# EAGLE design atmega328p (EAGLE 7.4.0)
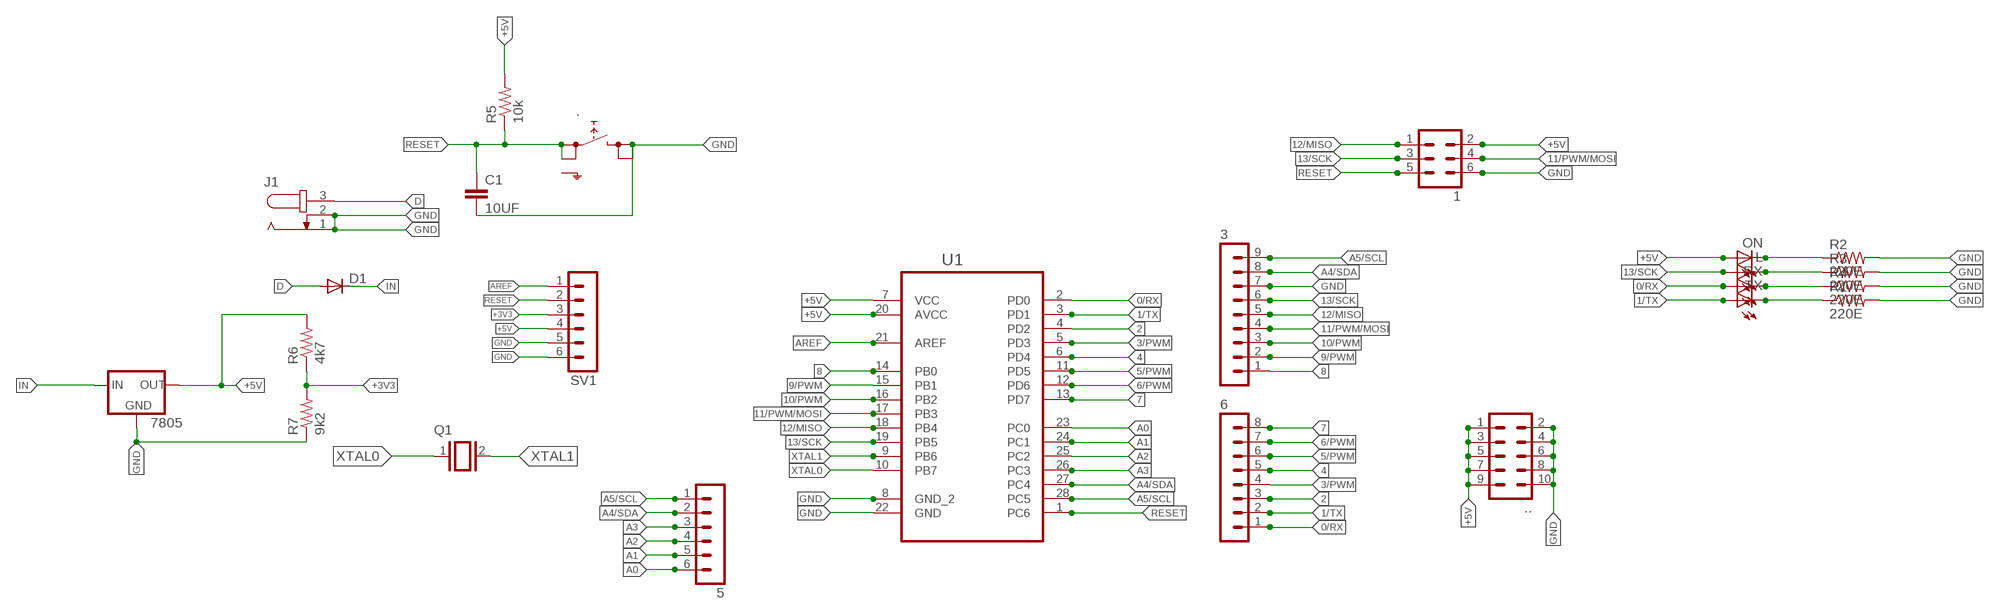
[diagram p0: schematic, sheet 1]

## Parts
1  MA03-2  [MA03-2]
3  MA09-1  [MA09-1]
5  MA06-1  [MA06-1]
6  MA08-1  [MA08-1]
7805  78XXS  [78XXS]
.  SKHMPSE010  [SKHMPXE010]
..  MA05-2  [MA05-2]
C1  10UF  C-EU025-025X050  [C025-025X050]
D1  1N4004  [DO41-10]
J1  JACK-PLUG0  [SPC4077]
L  LEDCHIP-LED0805  [CHIP-LED0805]
ON  LEDCHIP-LED0805  [CHIP-LED0805]
Q1  XTAL/S  [QS]
R1  220E  R-US_0204/7  [0204/7]
R2  220E  R-US_0204/7  [0204/7]
R3  220E  R-US_0204/7  [0204/7]
R4  220E  R-US_0204/7  [0204/7]
R5  10k  R-US_0204/7  [0204/7]
R6  4k7  R-US_0204/7  [0204/7]
R7  9k2  R-US_0204/7  [0204/7]
RX  LEDCHIP-LED0805  [CHIP-LED0805]
SV1  MA06-1  [MA06-1]
TX  LEDCHIP-LED0805  [CHIP-LED0805]
U1  ATMEGA328P-PU  [DIP254P762X457-28]

## Nets
0/RX: 6.1 RX.A U1.2(PD0)
1/TX: 6.2 TX.A U1.3(PD1)
2: 6.3 U1.4(PD2)
3/PWM: 6.4 U1.5(PD3)
4: 6.5 U1.6(PD4)
5/PWM: 6.6 U1.11(PD5)
6/PWM: 6.7 U1.12(PD6)
7: 6.8 U1.13(PD7)
8: 3.1 U1.14(PB0)
9/PWM: 3.2 U1.15(PB1)
10/PWM: 3.3 U1.16(PB2)
11/PWM/MOSI: 1.4 3.4 U1.17(PB3)
12/MISO: 1.1 3.5 U1.18(PB4)
13/SCK: 1.3 3.6 L.A U1.19(PB5)
+3V3: R6.1 R7.2 SV1.3
+5V: 1.2 7805.OUT ...1 ...3 ...5 ...7 ...9 ON.A R5.2 R6.2 SV1.4 U1.7(VCC) U1.20(AVCC)
A0: 5.6 U1.23(PC0)
A1: 5.5 U1.24(PC1)
A2: 5.4 U1.25(PC2)
A3: 5.3 U1.26(PC3)
A4/SDA: 3.8 5.2 U1.27(PC4)
A5/SCL: 3.9 5.1 U1.28(PC5)
AREF: SV1.1 U1.21(AREF)
D: D1.A J1.3
GND: 1.6 3.7 7805.GND ..3(2.1) ..4(2.2) ...2 ...4 ...6 ...8 ...10 C1.2 J1.1 J1.2 R1.2 R2.2 R3.2 R4.2 R7.1 SV1.5 SV1.6 U1.8(GND_2) U1.22(GND)
IN: 7805.IN D1.C
N$4: ON.C R2.1
N$5: L.C R3.1
N$6: R4.1 RX.C
N$7: R1.1 TX.C
RESET: 1.5 ..1(1.1) ..2(1.2) C1.1 R5.1 SV1.2 U1.1(PC6)
XTAL0: Q1.1 U1.10(PB7)
XTAL1: Q1.2 U1.9(PB6)
Unconnected: ..5(SH)

## Library data of the parts
1 = con-lstb:MA03-2: PIN HEADER; OC_FARNELL: unknown; OC_NEWARK: unknown
3 = con-lstb:MA09-1: PIN HEADER; OC_FARNELL: unknown; OC_NEWARK: unknown
5 SV1 = con-lstb:MA06-1: PIN HEADER; OC_FARNELL: unknown; OC_NEWARK: unknown
6 = con-lstb:MA08-1: PIN HEADER; OC_FARNELL: unknown; OC_NEWARK: unknown
7805 = v-reg:78XXS: VOLTAGE REGULATOR
. = switch:SKHMP*E010: 6.2 X 6.5mm TACT Switch (SMD) Source: http://www3.alps.co.jp/WebObjects/catalog.woa/PDF/E/Switch/Tact/SKHM/SKHM.PDF
.. = con-lstb:MA05-2: PIN HEADER; OC_FARNELL: unknown; OC_NEWARK: unknown
C1 = rcl:C-EU: CAPACITOR, European symbol
D1 = diode:1N4004: DIODE general purpose rectifier, 1 A
J1 = con-jack:JACK-PLUG: DC POWER JACK Power Jack, DC, Right Angle, Through Hole, Rated 5A at 16VDC, PC Terminals Distributor: Farnell (www.Farnell.de) Drawing: 84N1161.pdf / 84N1162.pdf Manufacturer: SPC Technology (www.spctechnology.com) Type: SPC4077 / SPC 4078; OC_FARNELL: unknown; OC_NEWARK: unknown
L ON RX TX = led:LED: LED OSRAM: - CHIPLED LG R971, LG N971, LY N971, LG Q971, LY Q971, LO R971, LY R971 LH N974, LH R974 LS Q976, LO Q976, LY Q976 LO Q996 - Hyper CHIPLED LW Q18S LB Q993, LB Q99A, LB R99A - SideLED LS A670, LO A670, LY A670, LG A670, LP A670 LB A673, LV A673, LT A673, LW A673 LH A674 LY A675 LS A676, LA A676, LO A676, LY A676, LW A676 LS A679, LY A679, LG A679 - Hyper Micro SIDELED® LS Y876, LA Y876, LO Y876, LY Y876 LT Y87S - SmartLED LW L88C, LW L88S LB L89C, LB L89S, LG L890 LS L89K, LO L89K, LY L89K LS L896, LA L896, LO L896, LY L896 - TOPLED LS T670, LO T670, LY T670, LG T670, LP T670 LSG T670, LSP T670, LSY T670, LOP T670, LYG T670 LG T671, LOG T671, LSG T671 LB T673, LV T673, LT T673, LW T673 LH T674 LS T676, LA T676, LO T676, LY T676, LB T676, LH T676, LSB T676, LW T676 LB T67C, LV T67C, LT T67C, LS T67K, LO T67K, LY T67K, LW E67C LS E67B, LA E67B, LO E67B, LY E67B, LB E67C, LV E67C, LT E67C LW T67C LS T679, LY T679, LG T679 LS T770, LO T770, LY T770, LG T770, LP T770 LB T773, LV T773, LT T773, LW T773 LH T774 LS E675, LA E675, LY E675, LS T675 LS T776, LA T776, LO T776, LY T776, LB T776 LHGB T686 LT T68C, LB T68C - Hyper Mini TOPLED® LB M676 - Mini TOPLED Santana® LG M470 LS M47K, LO M47K, LY M47K Source: http://www.osram.convergy.de LUXEON: - LUMILED® LXK2-PW12-R00, LXK2-PW12-S00, LXK2-PW14-U00, LXK2-PW14-V00 LXK2-PM12-R00, LXK2-PM12-S00, LXK2-PM14-U00 LXK2-PE12-Q00, LXK2-PE12-R00, LXK2-PE12-S00, LXK2-PE14-T00, LXK2-PE14-U00 LXK2-PB12-K00, LXK2-PB12-L00, LXK2-PB12-M00, LXK2-PB14-N00, LXK2-PB14-P00, LXK2-PB14-Q00 LXK2-PR12-L00, LXK2-PR12-M00, LXK2-PR14-Q00, LXK2-PR14-R00 LXK2-PD12-Q00, LXK2-PD12-R00, LXK2-PD12-S00 LXK2-PH12-R00, LXK2-PH12-S00 LXK2-PL12-P00, LXK2-PL12-Q00, LXK2-PL12-R00 Source: www.luxeon.com KINGBRIGHT: KA-3528ASYC Source: www.kingbright.com
Q1 = special:XTAL/S: CRYSTAL
R1-R7 = rcl:R-US_: RESISTOR, American symbol
U1 = Atmel_By_element14_Batch_1-00:ATMEGA328P-PU: 8-bit Microcontroller with In-System Programmable Flash; MPN: ATMEGA328P-PU; OC_FARNELL: 1715487; OC_NEWARK: 15R0268; PACKAGE: PDIP-28; SUPPLIER: Atmel

## Board
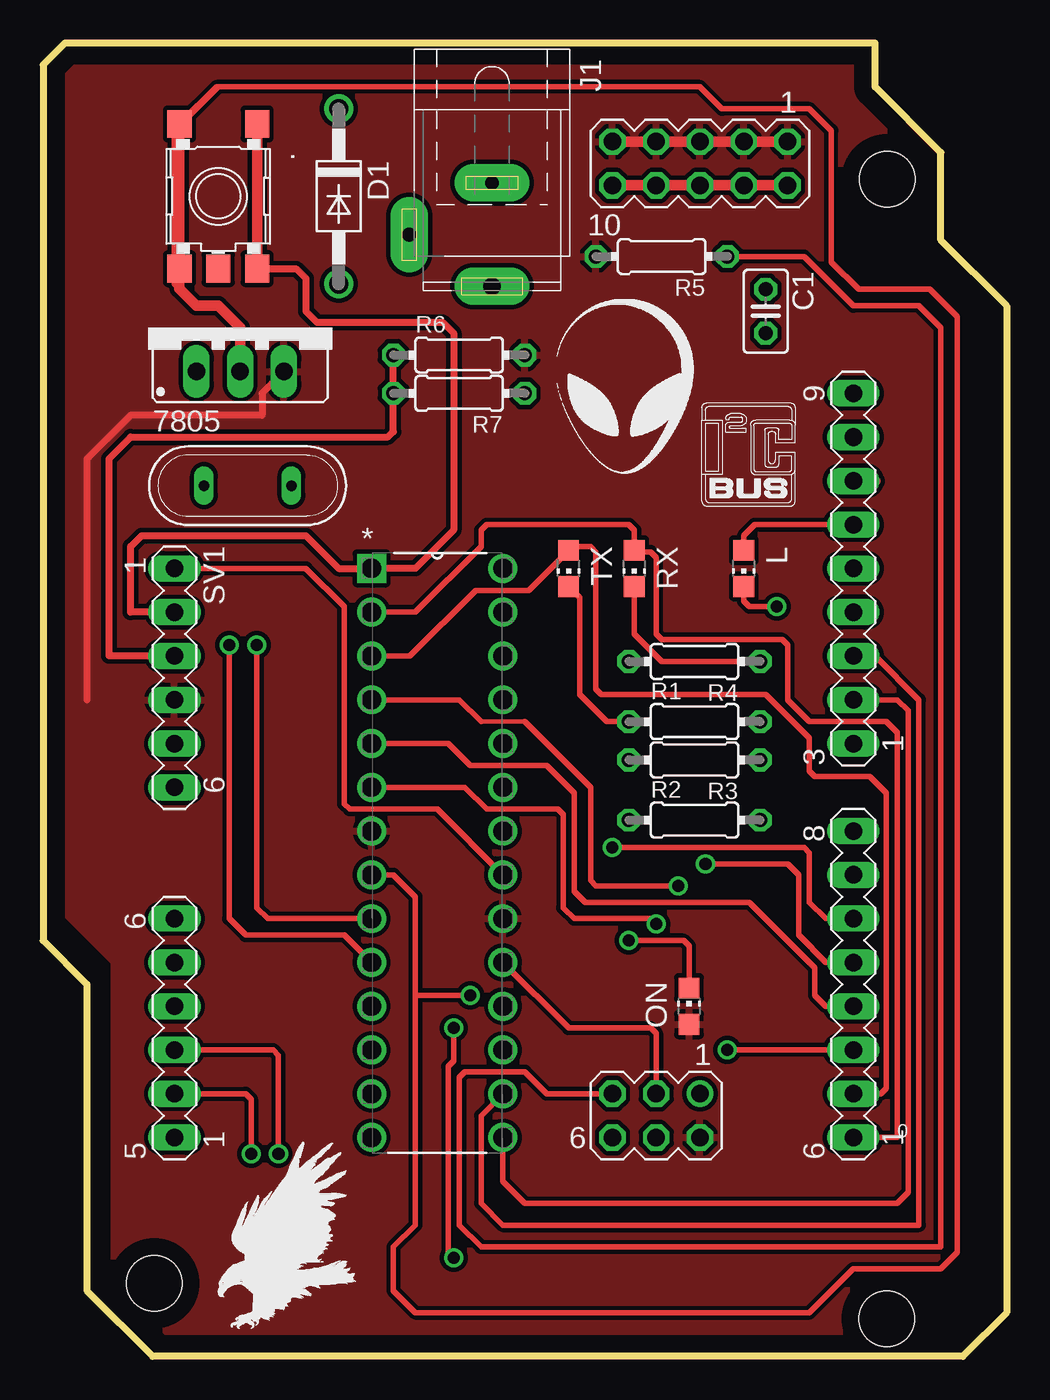
[diagram p1: board, top side]
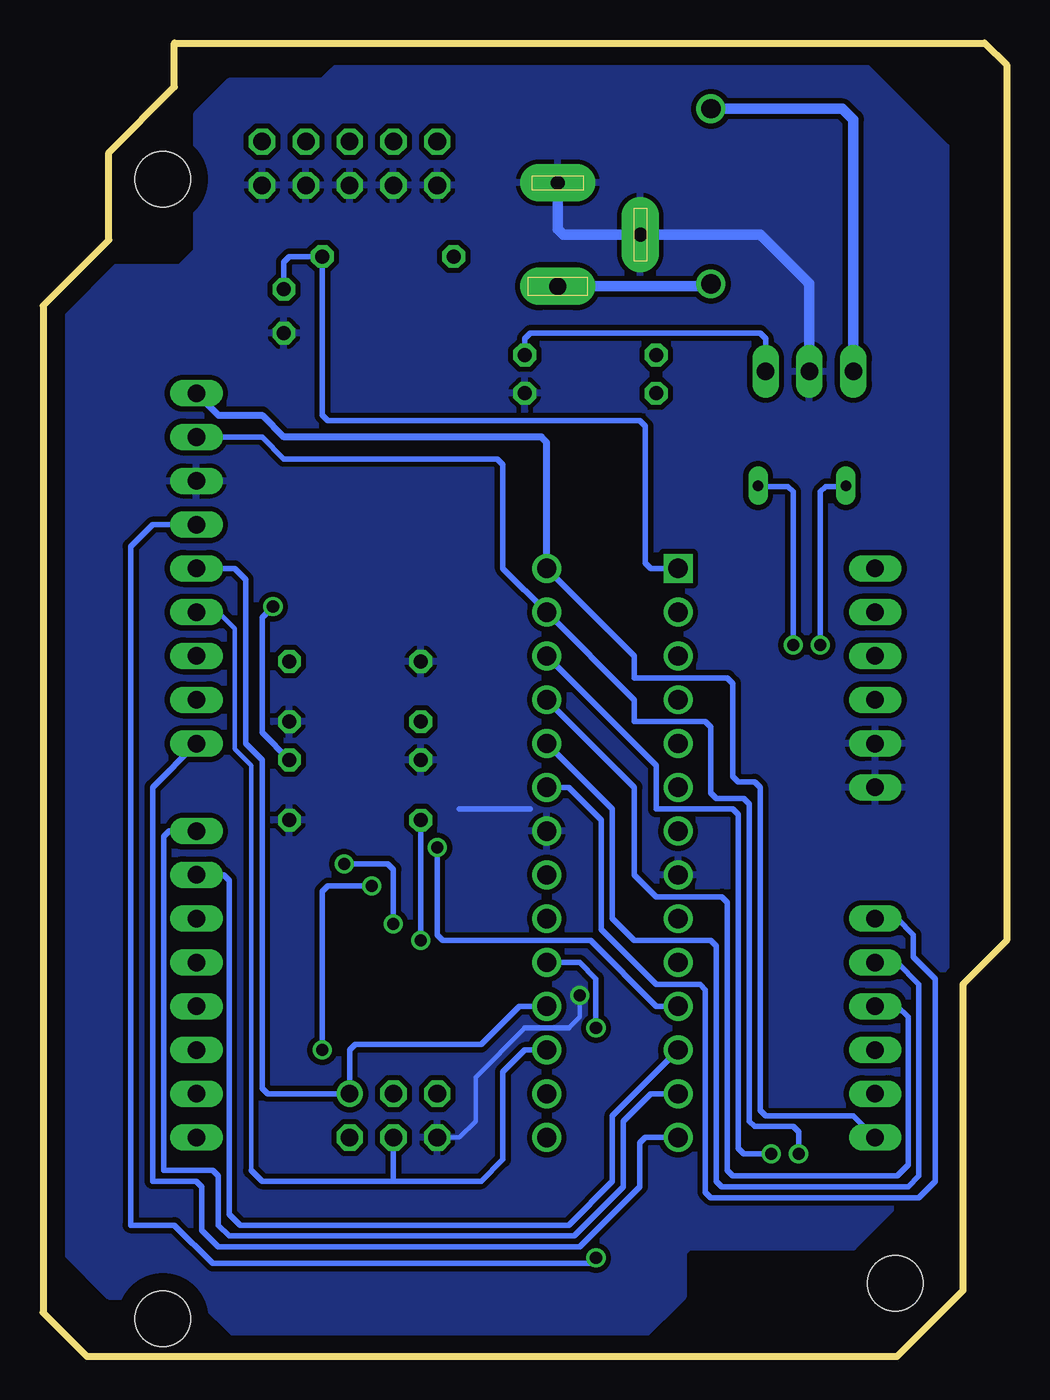
[diagram p2: board, bottom side, seen from below]

Size 55.88 x 76.2 mm. Coordinates in mm from the lower left corner, seen from the top.
Outline: 0,74.93 0,24.13 2.54,21.59 2.54,3.81 6.35,0 53.34,0 55.88,2.54 55.88,60.96 52.07,64.77 52.07,69.85 48.26,73.66 48.26,76.2 1.27,76.2 0,74.93
Copper layers (1*16): Top 0.035mm / dielectric 1.5mm / Bottom 0.035mm
Design rules "default": minimum track width 10mil, minimum drill 24mil, track to track 8mil, track to pad 8mil, pad to pad 8mil, via to via 8mil, smd to smd 8mil, copper to edge 40mil, drill to drill 8mil, minimum pad ring 10mil, minimum via ring 8mil, stop-mask expansion 4mil, vias tented up to drill 0mil, thermal gap 10mil
Holes 3.2 mm at 6.45,4.25 48.93,2.19 48.95,68.3

### Footprints (pad centres in the part's own frame; a part is rotated, then mirrored left to right if it is on the bottom)
MA03-2 = drill 1.016: 1 -2.54,-1.27 | drill 1.016 octagon: 2 -2.54,1.27; 3 0,-1.27; 4 0,1.27; 5 2.54,-1.27; 6 2.54,1.27
MA09-1 = drill 1.016 long: 1 -10.16,0; 2 -7.62,0; 3 -5.08,0; 4 -2.54,0; 5 0,0; 6 2.54,0; 7 5.08,0; 8 7.62,0; 9 10.16,0
MA06-1 = drill 1.016 long: 1 -6.35,0; 2 -3.81,0; 3 -1.27,0; 4 1.27,0; 5 3.81,0; 6 6.35,0
MA08-1 = drill 1.016 long: 1 -8.89,0; 2 -6.35,0; 3 -3.81,0; 4 -1.27,0; 5 1.27,0; 6 3.81,0; 7 6.35,0; 8 8.89,0
78XXS = drill 1.016 long: GND 0,-2.54; IN -2.54,-2.54; OUT 2.54,-2.54
SKHMPXE010 = smd 1.6 x 1.4: 1 -4.2,2.25; 2 4.2,2.25; 3 -4.2,-2.25; 4 4.2,-2.25; 5 4.2,0
MA05-2 = drill 1.016 octagon: 1 -5.08,-1.27; 2 -5.08,1.27; 3 -2.54,-1.27; 4 -2.54,1.27; 5 0,-1.27; 6 0,1.27; 7 2.54,-1.27; 8 2.54,1.27; 9 5.08,-1.27; 10 5.08,1.27
C025-025X050 = drill 0.813 octagon: 1 -1.27,0; 2 1.27,0
DO41-10 = drill 1.118: A 5.08,0; C -5.08,0
SPC4077 = drill 0.8 pad 2.184 long: 1 -3,0; 2 0,-4.8 | drill 1 pad 2.184 long: 3 3,0
CHIP-LED0805 = smd 1.2 x 1.2: A 0,-1.05; C 0,1.05
QS = drill 0.61 long: 1 -2.54,0; 2 2.54,0
0204/7 = drill 0.813 octagon: 1 -3.81,0; 2 3.81,0
DIP254P762X457-28 = drill 1.118 square: 1 -7.62,33.02 | drill 1.118: 2 -7.62,30.48; 3 -7.62,27.94; 4 -7.62,25.4; 5 -7.62,22.86; 6 -7.62,20.32; 7 -7.62,17.78; 8 -7.62,15.24; 9 -7.62,12.7; 10 -7.62,10.16; 11 -7.62,7.62; 12 -7.62,5.08; 13 -7.62,2.54; 14 -7.62,0; 15 0,0; 16 0,2.54; 17 0,5.08; 18 0,7.62; 19 0,10.16; 20 0,12.7; 21 0,15.24; 22 0,17.78; 23 0,20.32; 24 0,22.86; 25 0,25.4; 26 0,27.94; 27 0,30.48; 28 0,33.02

### Placement (x,y rotation side)
1  35.56,13.97 180 top
3  46.99,45.72 90 top
5  7.62,19.05 90 top
6  46.99,21.59 90 top
7805  11.43,59.69 0 top
.  10.16,67.31 270 top
..  38.1,69.22 180 top
C1  41.91,60.64 270 top
D1  17.14,67.31 270 top
J1  26.04,65.09 270 top
L  40.64,45.72 180 top
ON  37.47,20.32 0 top
Q1  11.86,50.52 0 top
R1  37.78,36.83 0 top
R2  37.78,31.11 0 top
R3  37.78,34.61 180 top
R4  37.78,40.32 180 top
R5  35.88,63.82 180 top
R6  24.13,58.1 0 top
R7  24.13,55.88 180 top
RX  34.29,45.72 180 top
SV1  7.62,39.37 270 top
TX  30.48,45.72 180 top
U1  26.67,12.7 0 top
U$2  [I2C]  38.19,49.3 0 top
U$4  [EAGLE-PLC-8MM]  10.16,1.59 0 top

### Tracks (layer width: path | path; a pad name or v marks a point on that pad's centre or on a via)
0/RX
  Top 0.305: U1.2 21.59,43.18 25.4,46.99 25.4,47.94 25.72,48.26 33.97,48.26 34.29,47.94 RX.A 34.39,46.67 35.24,46.67 35.56,46.35 35.56,41.91 35.88,41.59 42.86,41.59 43.18,41.27 43.18,38.1 44.45,36.83 48.89,36.83 49.53,36.2 49.53,12.7 6.1
1/TX
  Top 0.305: U1.3 21.27,40.64 25.08,44.45 28.16,44.45 TX.A | 6.2 48.58,15.24 48.89,15.56 48.89,32.7 47.94,33.66 44.77,33.66 44.45,33.97 44.45,35.88 41.91,38.42 32.39,38.42 32.07,38.73 32.07,46.67 31.75,46.99 30.7,46.99 TX.A | TX.A 30.58,46.77
2  (via drill 0.7)
  Top 0.254: 25.4,36.83 27.94,36.83
  Top 0.305: U1.4 24.13,38.1 25.4,36.83 | 27.94,36.83 31.75,33.02 31.75,27.62 32.07,27.3 v36.83,27.3 | 6.3 v39.69,17.78
  Bottom 0.305: v36.83,27.3 39.37,27.3 39.69,26.99 v39.69,17.78
3/PWM
  Top 0.305: U1.5 23.5,35.56 24.76,34.29 29.21,34.29 30.8,32.7 30.8,26.99 31.43,26.35 40.96,26.35 44.77,22.54 44.77,20.95 45.4,20.32 6.4
4  (via drill 0.7)
  Top 0.305: U1.6 24.45,33.02 25.72,31.75 29.85,31.75 30.16,31.43 30.16,26.04 30.8,25.4 35.24,25.4 v35.56,25.08 | 6.5 45.4,22.86 43.81,24.45 43.81,27.94 43.18,28.57 v38.42,28.57
  Bottom 0.305: v35.56,25.08 35.56,28.26 35.88,28.57 v38.42,28.57
5/PWM  (via drill 0.7)
  Top 0.305: 6.6 45.4,25.4 44.45,26.35 44.45,29.21 44.13,29.53 v33.02,29.53
  Bottom 0.305: U1.11 20.32,20.32 24.13,24.13 32.7,24.13 33.02,24.45 v33.02,29.53
6/PWM
  Bottom 0.305: U1.12 22.86,13.97 22.86,10.16 25.4,7.62 44.45,7.62 45.09,8.26 45.09,27.62 45.4,27.94 6.7
7
  Bottom 0.305: 6.8 48.58,30.48 48.89,30.16 48.89,10.79 46.04,10.79 45.72,10.48 45.72,7.62 45.09,6.99 25.08,6.99 22.22,9.84 22.22,13.65 20.64,15.24 U1.13
8
  Bottom 0.305: 3.1 49.53,33.02 49.53,10.16 46.99,10.16 46.67,9.84 46.67,7.3 45.72,6.35 24.76,6.35 21.27,9.84 21.27,12.38 20.96,12.7 U1.14
9/PWM
  Top 0.305: U1.15 26.67,10.16 27.94,8.89 49.53,8.89 50.17,9.53 50.17,37.47 49.53,38.1 3.2
10/PWM
  Top 0.305: U1.16 25.4,13.97 25.4,8.89 26.67,7.62 50.8,7.62 50.8,38.1 48.26,40.64 3.3
11/PWM/MOSI
  Bottom 0.254: 43.81,10.79 43.81,34.29 44.77,35.24 44.77,42.23 45.72,43.18
  Bottom 0.305: U1.17 27.94,17.78 29.21,16.51 29.21,11.43 30.48,10.16 35.56,10.16 | 3.4 45.72,43.18 | 35.56,10.16 43.18,10.16 43.81,10.79 | 1.4 35.56,10.16
12/MISO
  Bottom 0.305: 3.5 46.36,45.72 45.72,45.72 44.77,45.72 44.13,45.09 44.13,35.56 43.18,34.61 43.18,15.56 42.86,15.24 1.1 38.1,17.78 37.78,18.1 30.48,18.1 28.26,20.32 U1.18
13/SCK  (via drill 0.7)
  Top 0.305: U1.19 30.48,19.05 35.24,19.05 35.56,18.73 1.3 | L.A 40.64,47.62 41.28,48.26 3.6 | v23.81,19.05 23.81,17.14 23.5,16.83 23.5,6.03 v23.81,5.71
  Bottom 0.305: 3.6 49.53,48.26 50.8,46.99 50.8,7.62 48.26,7.62 46.04,5.4 24.13,5.4 v23.81,5.71 | U1.19 24.76,22.86 23.81,21.91 v23.81,19.05
+3V3
  Top 0.406: SV1.3 3.81,40.64 3.81,52.07 5.08,53.34 20,53.34 20.32,53.66 R7.2 R6.1
+5V
  Top 0.406: 7805.OUT 12.7,55.88 12.7,54.61 5.08,54.61 2.54,52.07 2.54,38.1
  Top 0.61: ...7 ...9 ...5 ...3 ...1
  Bottom 0.305: R6.2 27.94,59.05 27.62,59.37 14.29,59.37 13.97,59.05 7805.OUT
  pour Top (isolate 0.254): 1.9,75.25 46.99,75.25 46.99,73.34 50.8,69.53 50.8,64.45 54.29,60.96 54.29,3.17 52.39,1.27 7.3,1.27 4.13,4.45 4.13,22.86 1.59,25.4 1.27,25.72 1.27,74.61
A0
  Bottom 0.305: 5.6 6.35,25.4 5.4,24.45 5.4,23.18 4.13,21.91 4.13,10.16 5.08,9.21 17.14,9.21 17.46,9.53 17.46,21.27 17.78,21.59 20.32,21.59 23.5,24.77 23.5,31.11 25.4,33.02 U1.23
A1
  Bottom 0.305: U1.24 22.86,31.75 22.86,25.4 21.59,24.13 17.14,24.13 16.83,23.81 16.83,10.16 16.51,9.84 5.71,9.84 5.08,10.48 5.08,21.59 6.35,22.86 5.5
A2
  Bottom 0.305: U1.25 21.59,33.02 21.59,27.94 20.32,26.67 16.51,26.67 16.19,26.35 16.19,10.79 15.87,10.48 6.35,10.48 5.71,11.11 5.71,19.68 6.35,20.32 5.4
A3  (via drill 0.7)
  Top 0.305: 5.3 13.33,17.78 13.65,17.46 v13.65,11.75
  Bottom 0.305: U1.26 20.32,34.29 20.32,31.75 15.87,31.75 15.56,31.43 15.56,12.06 15.24,11.75 v13.65,11.75
A4/SDA  (via drill 0.7)
  Top 0.305: 5.2 11.75,15.24 12.06,14.92 v12.06,11.75
  Bottom 0.305: 3.8 43.18,53.34 41.91,52.07 29.53,52.07 29.21,51.75 29.21,45.72 U1.27 21.59,38.1 21.59,36.83 17.46,36.83 17.14,36.51 17.14,32.7 16.83,32.38 15.24,32.38 14.92,32.07 14.92,13.65 14.61,13.34 12.38,13.34 12.06,13.02 v12.06,11.75
A5/SCL
  Bottom 0.305: U1.28 21.59,40.64 21.59,39.37 16.19,39.37 15.87,39.05 15.87,33.66 15.56,33.34 14.61,33.34 14.29,33.02 14.29,14.29 13.97,13.97 8.89,13.97 5.1
  Bottom 0.406: 3.9 45.72,54.61 43.18,54.61 41.91,53.34 26.99,53.34 26.67,53.02 U1.28
AREF
  Top 0.305: U1.21 22.86,31.75 17.78,31.75 17.46,32.07 17.46,43.5 15.24,45.72 SV1.1
D
  Bottom 0.61: J1.3 17.29,62.09 D1.A
GND  (via drill 0.7)
  Top 0.305: 21.59,20.95 21.59,26.67 20.32,27.94 U1.8 | 21.59,20.95 21.59,7.62 20.32,6.35 20.32,3.81 21.59,2.54 44.45,2.54 46.99,5.08 52.07,5.08 53.02,6.03 53.02,60.33 51.44,61.91 47.31,61.91 45.72,63.5 45.72,71.12 44.45,72.39 39.37,72.39 38.1,73.66 10.16,73.66 | 10.16,73.66 10.06,73.66 ..3 | 10.16,73.66 7.62,71.12 7.62,62.23 8.89,60.96 | v24.76,20.95 21.59,20.95
  Top 0.61: ..3 ..4 7.91,61.94 8.89,60.96 10.16,60.96 11.43,59.69 7805.GND | 48.26,50.8 3.7 | ...10 ...8 ...6 ...4 ...2 ...10
  Bottom 0.254: 1.6 31.75,12.7 30.8,13.65 30.8,16.19 27.94,19.05 | 25.4,19.05 24.76,19.68 v24.76,20.95
  Bottom 0.305: U1.22 26.67,30.8 | 27.62,31.75 31.75,31.75 | 25.4,19.05 27.94,19.05
  Bottom 0.61: 7805.GND 11.43,62.23 14.29,65.09 J1.2 25.72,65.09 26.04,65.41 J1.1
  pour Bottom (isolate 0.305): 8.89,75.25 38.42,75.25 39.69,73.98 45.09,73.98 46.99,72.07 46.99,64.14 47.94,63.18 52.39,63.18 54.61,60.96 54.61,6.03 52.07,3.49 46.99,3.49 44.45,0.95 21.27,0.95 18.73,3.49 18.73,6.03 18.42,6.35 8.89,6.35 3.49,11.75 3.49,70.17 8.57,75.25
IN
  Bottom 0.61: 7805.IN 8.89,71.75 9.52,72.39 D1.C
N$4  (via drill 0.7)
  Top 0.305: ON.C 37.47,23.81 37.15,24.13 v33.97,24.13
  Bottom 0.305: R2.1 v33.97,24.13
N$5  (via drill 0.7)
  Top 0.305: L.C 40.64,43.81 40.96,43.5 v42.55,43.5
  Bottom 0.305: R3.1 43.18,36.2 43.18,42.86 v42.55,43.5
N$6
  Top 0.305: RX.C 34.29,41.91 35.88,40.32 R4.1
N$7
  Top 0.305: R1.1 32.7,36.83 31.11,38.42 31.11,44.03 TX.C
RESET
  Top 0.305: 1.5 29.21,15.24 27.94,16.51 24.45,16.51 24.13,16.19 24.13,7.62 25.4,6.35 52.07,6.35 52.07,59.69 50.8,60.96 46.99,60.96 44.13,63.82 R5.1
  Top 0.406: ..2 14.68,63.11 15.24,62.55 15.24,60.64 15.87,60.01 23.18,60.01 23.81,59.37 23.81,47.94 21.59,45.72 U1.1 17.14,45.72 15.24,47.62 5.71,47.62 5.08,46.99 5.08,43.18 SV1.2
  Top 0.61: ..2 ..1
  Bottom 0.305: C1.1 41.91,63.5 41.59,63.82 R5.1 39.69,54.61 39.37,54.29 21.27,54.29 20.96,53.98 20.96,46.04 20.64,45.72 U1.1
XTAL0  (via drill 0.7)
  Top 0.305: U1.10 17.46,24.45 11.75,24.45 10.79,25.4 v10.79,41.27
  Bottom 0.305: v10.79,41.27 10.79,50.16 10.48,50.48 9.36,50.48 Q1.1
XTAL1  (via drill 0.7)
  Top 0.305: v12.38,41.27 12.38,26.04 13.02,25.4 U1.9
  Bottom 0.305: v12.38,41.27 12.38,50.16 12.7,50.48 14.36,50.48 Q1.2

### Text on the board
tNames: 0
tValues: ATmega328P | +5V | RESET | GND | SCL | SDA | GND | 13 | 16M | AREF | 12 | RESET | 11 | +3V3 | 10 | +5V | 9 | GND | 8 | GND | Arduino | 7 | ONU | 6 | 5 | A0 | ANALOG INPUTS | A1 | 4 | A2 | 3 | A3 | 2 | A4 | TX | 1 | A5 | RX | 0 | - | ICSP | - by Anand